# EAGLE design fish_tank (EAGLE 7.5.0)
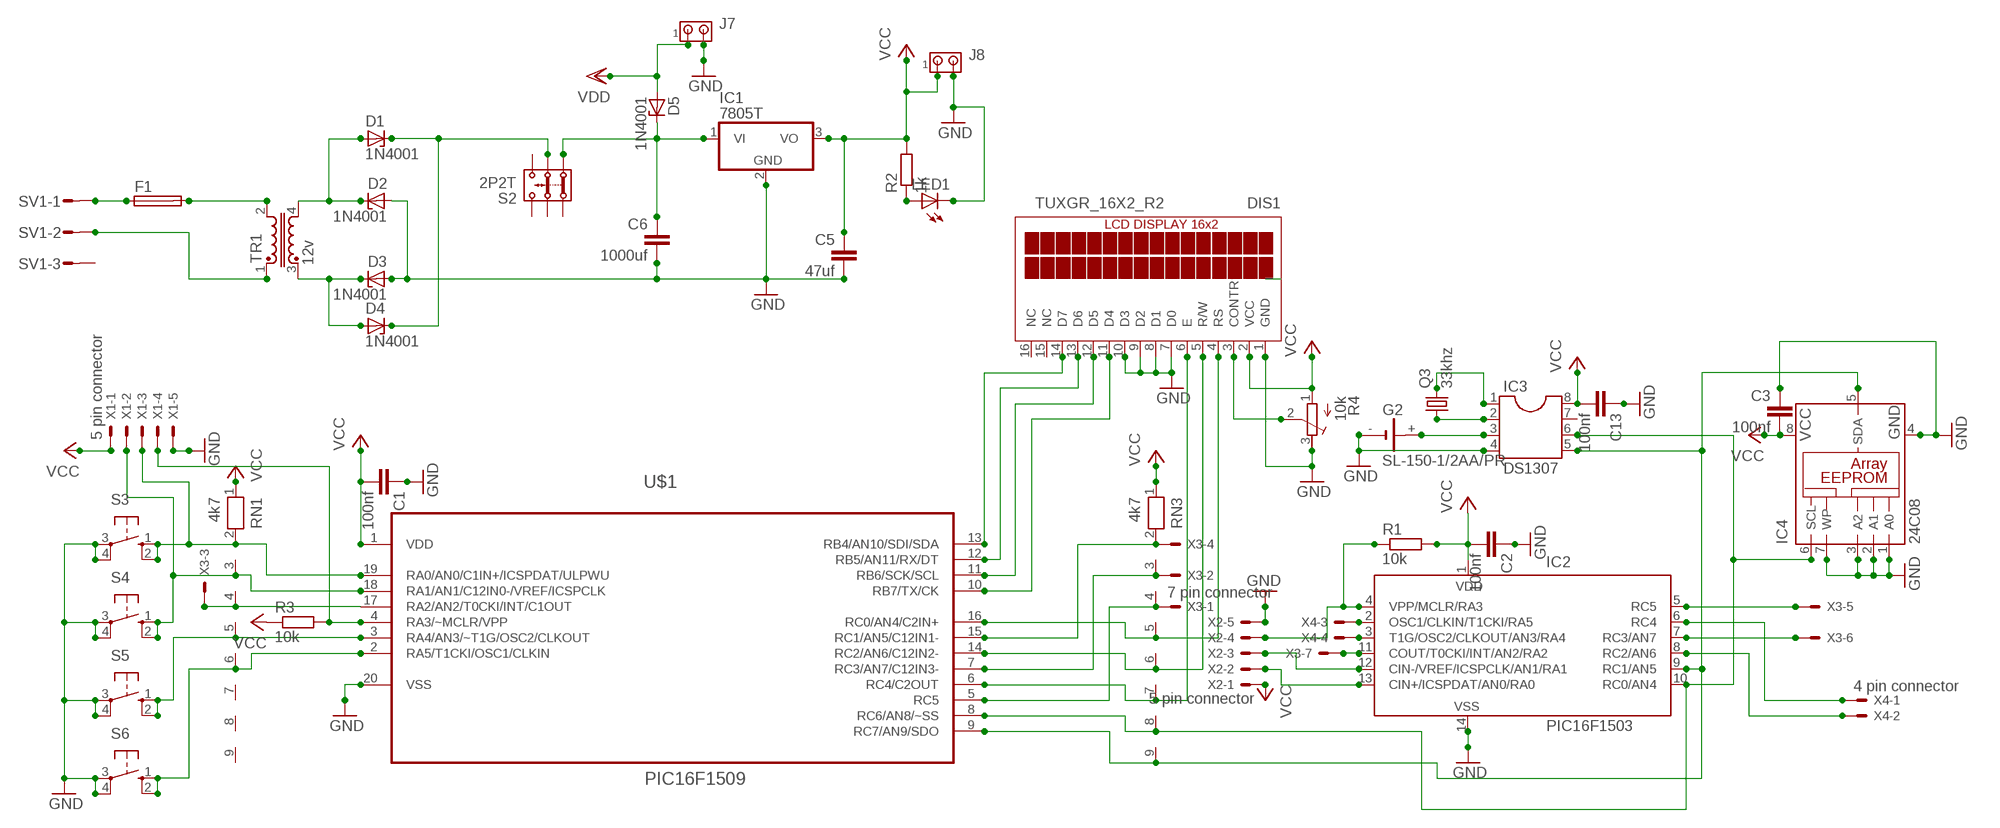
[diagram p0: schematic, sheet 1]

## Parts
C1  100nf  C2.5/4  [C2.5-4]
C2  100nf  C2.5/4  [C2.5-4]
C3  100nf  C5/2.5  [C5B2.5]
C5  47uf  C5/2.5  [C5B2.5]
C6  1000uf  C5/2.5  [C5B2.5]
C13  100nf  C5/2.5  [C5B2.5]
D1  1N4001  1N821  [DO35Z10]
D2  1N4001  1N821  [DO35Z10]
D3  1N4001  1N821  [DO35Z10]
D4  1N4001  1N821  [DO35Z10]
D5  1N4001  1N821  [DO35Z10]
DIS1  TUXGR_16X2_R2  [TUXGR_16X2_R2]
F1  SH25  [SH25]
G2  SL-150-1/2AA/PR  [SL-150-1/2AA/PR]
IC1  7805T  [TO220H]
IC2  PIC16F1503  PIC16F676P  [DIL14]
IC3  DS1307  DIL8  [DIL08]
IC4  24C08  24C04CP  [DIL8]
J7  MTA02-100  [10X02MTA]
J8  MTA02-100  [10X02MTA]
LED1  LED3MM  [LED3MM]
Q3  33khz  CRYSTALTC26H  [TC26H]
R1  10k  R-EU_0207/7  [0207/7]
R2  1k  R-EU_0204/5  [0204/5]
R3  10k  R-EU_0207/7  [0207/7]
R4  10k  R-TRIMM64W  [RTRIM64W]
RN1  4k7  RN08  [RN-9]
RN3  4k7  RN08  [RN-9]
S2  2P2T  [2P2T]
S3  10-XX  [B3F-10XX]
S4  10-XX  [B3F-10XX]
S5  10-XX  [B3F-10XX]
S6  10-XX  [B3F-10XX]
SV1  MT6-3Y  [MT6-3Y]
TR1  12v  U15-TRANSFORMER  [U15]
U$1  PIC16F1509  PIC16F689-I/P  [DIP254P762X533-20]
X1  5 pin connector  22-23-2051  [22-23-2051]
X2  5 pin connector  22-23-2051  [22-23-2051]
X3  7 pin connector  22-23-2071  [22-23-2071]
X4  4 pin connector  22-23-2041  [22-23-2041]

## Nets
GND: C1.1 C2.1 C3.1 C5.2 C6.2 C13.1 D2.A D3.A DIS1.1(GND) DIS1.7(D0) DIS1.8(D1) DIS1.9(D2) DIS1.10(D3) G2.- IC1.2(GND) IC2.14(VSS) IC3.4 IC4.1(A0) IC4.2(A1) IC4.3(A2) IC4.4(GND) IC4.7(WP) J7.2 J8.2 LED1.K(C) R4.3(E) S3.3(P) S3.4(P1) S4.3(P) S4.4(P1) S5.3(P) S5.4(P1) S6.3(P) S6.4(P1) U$1.20(VSS) X1.5 X2.5
N$1: D3.C D4.A TR1.3
N$2: D1.A D2.C TR1.4
N$3: RN1.5 S5.1(S) S5.2(S1) U$1.3(RA4/AN3/~T1G/OSC2/CLKOUT)
N$4: DIS1.3(CONTR) R4.2(S)
N$5: RN1.6 S6.1(S) S6.2(S1) U$1.2(RA5/T1CKI/OSC1/CLKIN)
N$6: C6.1 D5.C IC1.1(VI) S2.1.2
N$7: RN1.2 S3.1(S) S3.2(S1) U$1.19(RA0/AN0/C1IN+/ICSPDAT/ULPWU) X1.3
N$8: RN1.3 S4.1(S) S4.2(S1) U$1.18(RA1/AN1/C12IN0-/VREF/ICSPCLK) X1.2
N$9: IC2.13(CIN+/ICSPDAT/AN0/RA0) X2.2
N$10: IC2.6(RC4) X4.1
N$12: IC2.4(VPP/MCLR/RA3) R1.1 X2.4
N$13: DIS1.6(E) RN3.7 U$1.6(RC4/C2OUT)
N$14: IC2.5(RC5) X3.5
N$15: IC2.7(RC3/AN7) X3.6
N$16: DIS1.4(RS) RN3.5 U$1.16(RC0/AN4/C2IN+)
N$17: DIS1.5(R/W) RN3.6 U$1.14(RC2/AN6/C12IN2-)
N$18: IC2.10(RC0/AN4) IC3.6 IC4.6(SCL) RN3.8 U$1.8(RC6/AN8/~SS)
N$19: IC2.11(COUT/T0CKI/INT/AN2/RA2) X3.7
N$20: IC2.12(CIN-/VREF/ICSPCLK/AN1/RA1) X2.3
N$21: IC2.9(RC1/AN5) IC3.5 IC4.5(SDA) RN3.9 U$1.9(RC7/AN9/SDO)
N$22: RN1.4 U$1.17(RA2/AN2/T0CKI/INT/C1OUT) X3.3
N$23: RN3.2 U$1.15(RC1/AN5/C12IN1-) X3.4
N$24: RN3.3 U$1.7(RC3/AN7/C12IN3-) X3.2
N$25: RN3.4 U$1.5(RC5) X3.1
N$26: DIS1.14(D7) U$1.13(RB4/AN10/SDI/SDA)
N$27: DIS1.13(D6) U$1.12(RB5/AN11/RX/DT)
N$28: DIS1.12(D5) U$1.11(RB6/SCK/SCL)
N$29: DIS1.11(D4) U$1.10(RB7/TX/CK)
N$30: R3.2 U$1.4(RA3/~MCLR/VPP) X1.4
N$31: IC2.8(RC2/AN6) X4.2
N$32: IC2.2(OSC1/CLKIN/T1CKI/RA5) X4.3
N$33: IC2.3(T1G/OSC2/CLKOUT/AN3/RA4) X4.4
N$38: SV1.2 TR1.1
N$57: F1.1 SV1.1
N$61: F1.2 TR1.2
N$63: G2.+ IC3.3
N$64: IC3.2 Q3.1
N$65: D1.C D4.C S2.2.2
N$66: LED1.A R2.1
N$70: IC3.1 Q3.2
VCC: C1.2 C2.2 C3.2 C5.1 C13.2 DIS1.2(VCC) IC1.3(VO) IC2.1(VDD) IC3.8 IC4.8(VCC) J8.1 R1.2 R2.2 R3.1 R4.1(A) RN1.1 RN3.1 U$1.1(VDD) X1.1 X2.1
VDD: D5.A J7.1
Unconnected: DIS1.15(NC) DIS1.16(NC) IC3.7 RN1.7 RN1.8 RN1.9 S2.1.1 S2.2.1 S2.3.1 S2.3.2 SV1.3

## Library data of the parts
C1-C3 C5 C6 C13 = capacitor-wima:C: CAPACITOR naming: grid - package width
D1-D5 = diode:1N821: Reference DIODE temperature compensated, 6,2 V
DIS1 = display-lcd:TUXGR_16X2_R2: Tuxgraphics LCD display 16x2 characters reflective, without background light Source: tuxgr_12x2_r2.pdf; OC_FARNELL: unknown; OC_NEWARK: unknown
F1 = fuse:SH25: FUSE HOLDER grid 25 mm, OGN0031 8211, Schurter (Buerklin); MF: SCHURTER; MPN: 0031.8211; OC_FARNELL: 1162741; OC_NEWARK: 96B9380
G2 = battery:SL-150-1/2AA/PR: LI BATTERY Sonnenschein
IC1 = linear:78*: Positive VOLTAGE REGULATOR Source: http://cache.national.com/ds/LM/LM78L05.pdf http://www.fairchildsemi.com/ds/LM/LM7805.pdf
IC2 = microchip:PIC16F676: 14-Pin, Flash-Based 8-Bit CMOS Microcontroller High Performance RISC CPU: * Only 35 instructions to learn - All single-cycle instructions except branches * Operating speed: - DC - 20 MHz oscillator/clock input - DC - 200 ns instruction cycle * Internal and external oscillator options - Precision Internal 4 MHz oscillator factory calibrated to ±1% - External Oscillator support for crystals and resonators - 5?s wake-up from SLEEP, 3.0V, typical * Power saving SLEEP mode * Wide operating voltage range - 2.0V to 5.5V * Industrial and Extended temperature range * Low power Power-on Reset (POR) * Power-up Timer (PWRT) and Oscillator Start-up Timer (OST) * Brown-out Detect (BOD) * Watchdog Timer (WDT) with independent oscillator for reliable operation * Multiplexed MCLR/Input-pin * Interrupt-on-pin change * Individual programmable weak pull-ups * Programmable code protection * High Endurance FLASH/EEPROM Cell - 100,000 write FLASH endurance - 1,000,000 write EEPROM endurance - FLASH/Data EEPROM Retention: > 40 years * Standby Current: - 1 nA @ 2.0V, typical * Operating Current: - 8.5?A @ 32 kHz, 2.0V, typical - 100?A @ 1 MHz, 2.0V, typical * Watchdog Timer Current - 300 nA @ 2.0V, typical * Timer1 oscillator current: - 4?A @ 32 kHz, 2.0V, typical * 12 I/O pins with individual direction control * High current sink/source for direct LED drive * Analog-to-Digital Converter module (PIC16F676): - 10-bit resolution - Programmable 8-channel input - Voltage reference input * In-Circuit Serial ProgrammingTM (ICSPTM) via two pins Source: http://ww1.microchip.com/downloads/en/DeviceDoc/40039E.pdf; MF: MICROCHIP; MPN: PIC16F676-I/P; OC_FARNELL: 9760512; OC_NEWARK: 54K2829
IC3 = ic-package:DIL8: Dual In Line / Socket
IC4 = microchip:24C*: Serial EEPROM 1 K/2 K/4 K; MPN: CAT24C04LI-G; OC_FARNELL: 1718374; OC_NEWARK: 73P4460
J7 J8 = con-amp:MTA02-100: AMP connector
LED1 = led:LED: LED OSRAM: - CHIPLED LG R971, LG N971, LY N971, LG Q971, LY Q971, LO R971, LY R971 LH N974, LH R974 LS Q976, LO Q976, LY Q976 LO Q996 - Hyper CHIPLED LW Q18S LB Q993, LB Q99A, LB R99A - SideLED LS A670, LO A670, LY A670, LG A670, LP A670 LB A673, LV A673, LT A673, LW A673 LH A674 LY A675 LS A676, LA A676, LO A676, LY A676, LW A676 LS A679, LY A679, LG A679 - Hyper Micro SIDELED® LS Y876, LA Y876, LO Y876, LY Y876 LT Y87S - SmartLED LW L88C, LW L88S LB L89C, LB L89S, LG L890 LS L89K, LO L89K, LY L89K LS L896, LA L896, LO L896, LY L896 - TOPLED LS T670, LO T670, LY T670, LG T670, LP T670 LSG T670, LSP T670, LSY T670, LOP T670, LYG T670 LG T671, LOG T671, LSG T671 LB T673, LV T673, LT T673, LW T673 LH T674 LS T676, LA T676, LO T676, LY T676, LB T676, LH T676, LSB T676, LW T676 LB T67C, LV T67C, LT T67C, LS T67K, LO T67K, LY T67K, LW E67C LS E67B, LA E67B, LO E67B, LY E67B, LB E67C, LV E67C, LT E67C LW T67C LS T679, LY T679, LG T679 LS T770, LO T770, LY T770, LG T770, LP T770 LB T773, LV T773, LT T773, LW T773 LH T774 LS E675, LA E675, LY E675, LS T675 LS T776, LA T776, LO T776, LY T776, LB T776 LHGB T686 LT T68C, LB T68C - Hyper Mini TOPLED® LB M676 - Mini TOPLED Santana® LG M470 LS M47K, LO M47K, LY M47K Source: http://www.osram.convergy.de LUXEON: - LUMILED® LXK2-PW12-R00, LXK2-PW12-S00, LXK2-PW14-U00, LXK2-PW14-V00 LXK2-PM12-R00, LXK2-PM12-S00, LXK2-PM14-U00 LXK2-PE12-Q00, LXK2-PE12-R00, LXK2-PE12-S00, LXK2-PE14-T00, LXK2-PE14-U00 LXK2-PB12-K00, LXK2-PB12-L00, LXK2-PB12-M00, LXK2-PB14-N00, LXK2-PB14-P00, LXK2-PB14-Q00 LXK2-PR12-L00, LXK2-PR12-M00, LXK2-PR14-Q00, LXK2-PR14-R00 LXK2-PD12-Q00, LXK2-PD12-R00, LXK2-PD12-S00 LXK2-PH12-R00, LXK2-PH12-S00 LXK2-PL12-P00, LXK2-PL12-Q00, LXK2-PL12-R00 Source: www.luxeon.com KINGBRIGHT: KA-3528ASYC Source: www.kingbright.com
Q3 = crystal:CRYSTAL: CRYSTAL; OC_FARNELL: unknown; OC_NEWARK: unknown
R1 R3 = rcl:R-EU_: RESISTOR, European symbol
R2 = resistor:R-EU_: RESISTOR, European symbol
R4 = rcl:R-TRIMM: Trimm resistor
RN1 RN3 = resistor-net:RN08: RESISTOR NETWORK; OC_FARNELL: unknown; OC_NEWARK: unknown
S2 = switch:2P2T: SLIDE SWITCH 2P2T Part No. SS-22F05-G(A)4 Source: CANAL ELECTRONIC CO., LTD .. switsch.pdf
S3-S6 = switch-omron:10-XX: OMRON SWITCH; MPN: B3F-1000; OC_FARNELL: 176432; OC_NEWARK: 36M3542
SV1 = con-amp-mt:MT6-3Y: AMP MT6 CONNECTOR; OC_FARNELL: unknown; OC_NEWARK: unknown
TR1 = inductor-neosid:U15: TRANSFORMER U15; OC_FARNELL: unknown; OC_NEWARK: unknown
U$1 = Microchip_By_element14_Batch_1:PIC16F689-I/P: CMOS Microcontrollers; MPN: PIC16F689-I/P; OC_FARNELL: 1103403; OC_NEWARK: 56J7539; PACKAGE: DIP-20; SUPPLIER: Microchip
X1 X2 = con-molex:22-23-2051: .100" (2.54mm) Center Header - 5 Pin; MF: MOLEX; MPN: 22-23-2051; OC_FARNELL: 1462952; OC_NEWARK: 38C9178
X3 = con-molex:22-23-2071: .100" (2.54mm) Center Header - 7 Pin; MF: MOLEX; MPN: 22-23-2071; OC_FARNELL: 1654534; OC_NEWARK: 56H0445
X4 = con-molex:22-23-2041: .100" (2.54mm) Center Header - 4 Pin; MF: MOLEX; MPN: 22-23-2041; OC_FARNELL: 1462920; OC_NEWARK: 38C0355

## Board
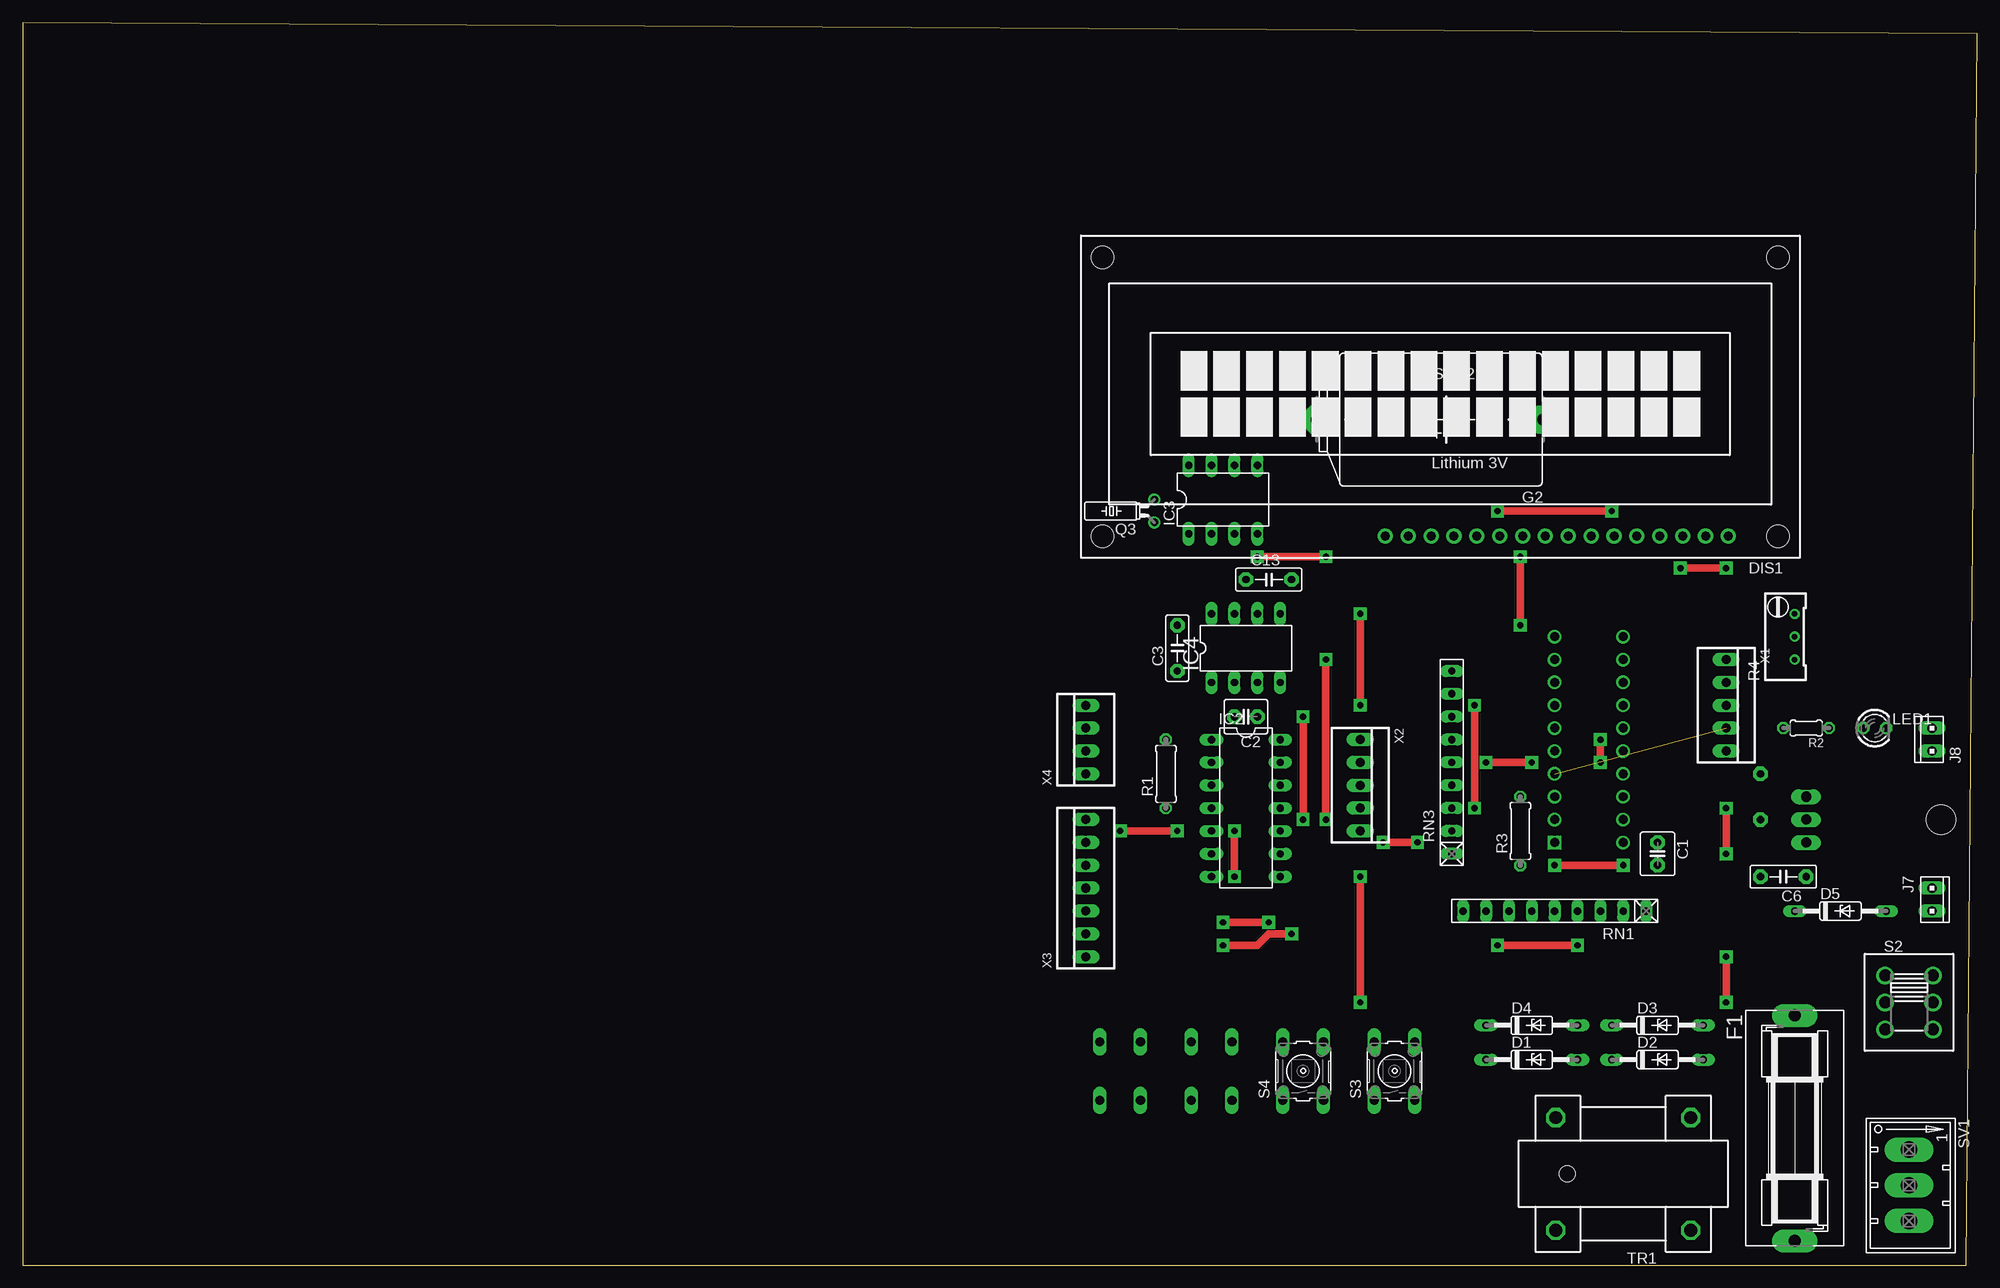
[diagram p1: board, top side]
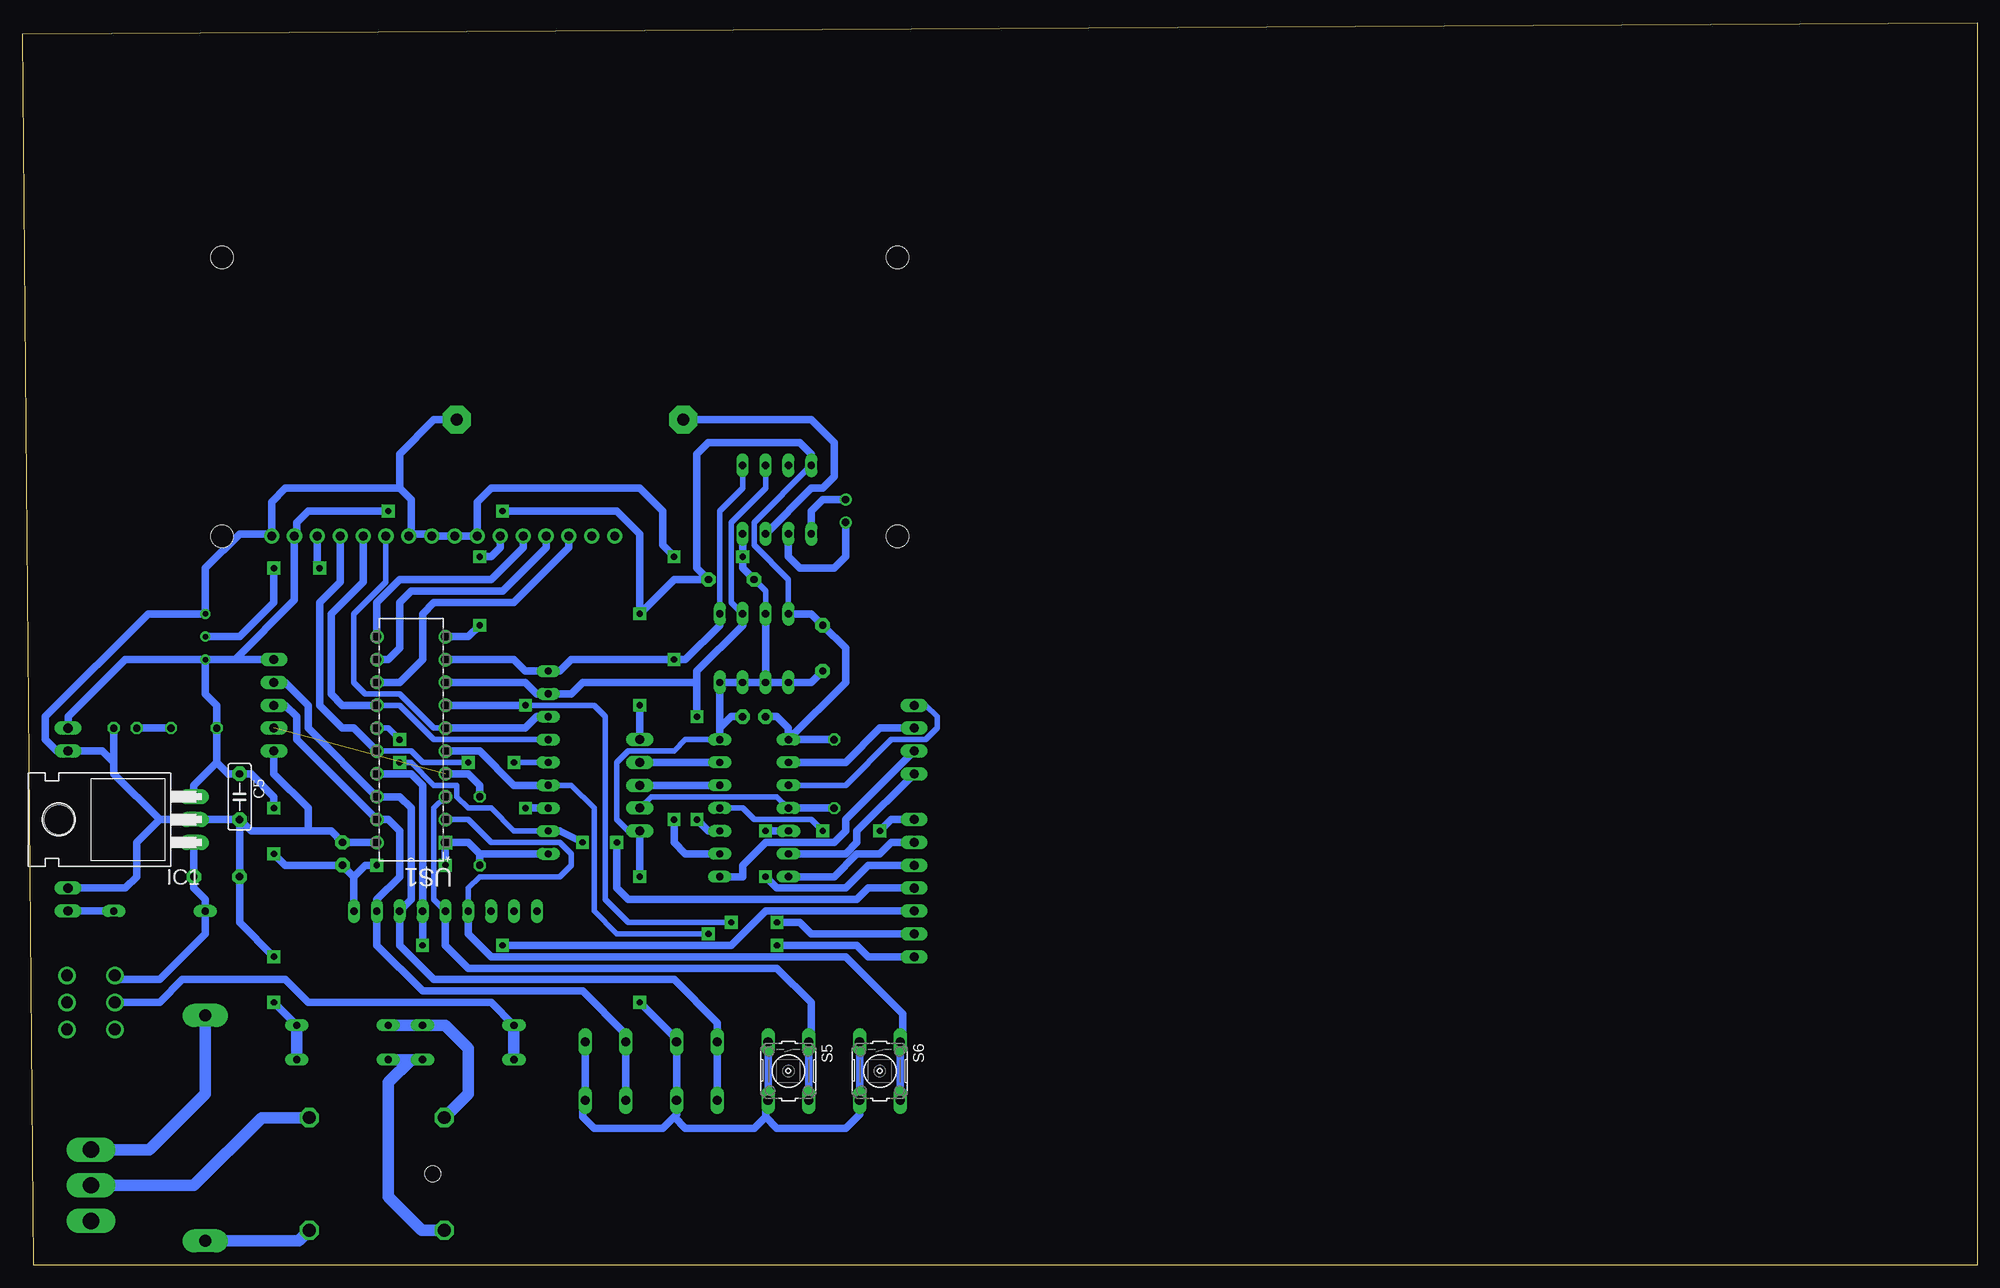
[diagram p2: board, bottom side, seen from below]

Size 217.15 x 138.1 mm. Coordinates in mm from the lower left corner, seen from the top.
Outline: 0,0 215.88,0 217.15,136.83 0,138.1 0,0
Copper layers (1*16): Top 0.035mm / dielectric 1.5mm / Bottom 0.035mm
Design rules "default": minimum track width 10mil, minimum drill 24mil, track to track 8mil, track to pad 8mil, pad to pad 8mil, via to via 8mil, smd to smd 8mil, copper to edge 40mil, drill to drill 8mil, minimum pad ring 10mil, minimum via ring 8mil, stop-mask expansion 4mil, vias tented up to drill 0mil, thermal gap 10mil

### Footprints (pad centres in the part's own frame; a part is rotated, then mirrored left to right if it is on the bottom)
C2.5-4 = drill 0.813 pad 1.6 octagon: 1 -1.27,0; 2 1.27,0
C5B2.5 = drill 0.813 pad 1.6 octagon: 1 -2.54,0; 2 2.54,0
DO35Z10 = drill 0.813 long: A 5.08,0; C -5.08,0
TUXGR_16X2_R2 = drill 1 pad 1.676: 1 -32,15.5; 2 -29.46,15.5; 3 -26.92,15.5; 4 -24.38,15.5; 5 -21.84,15.5; 6 -19.3,15.5; 7 -16.76,15.5; 8 -14.22,15.5; 9 -11.68,15.5; 10 -9.14,15.5; 11 -6.6,15.5; 12 -4.06,15.5; 13 -1.52,15.5; 14 1.02,15.5; 15 3.56,15.5; 16 6.1,15.5 | hole 2.5: -37.5,-15.5; 37.5,-15.5; -37.5,15.5; 37.5,15.5
SH25 = drill 1.321 pad 2.54 long: 1 -12.522,0; 2 12.522,0
SL-150-1/2AA/PR = drill 1.321 pad 3.15 octagon: + 12.446,0; - -12.7,0
TO220H = drill 1.118 long: 1 -2.54,-10.16; 2 0,-10.16; 3 2.54,-10.16 | hole 3.302: 0,4.826
DIL14 = drill 0.813 long: 1 -7.62,-3.81; 2 -5.08,-3.81; 3 -2.54,-3.81; 4 0,-3.81; 5 2.54,-3.81; 6 5.08,-3.81; 7 7.62,-3.81; 8 7.62,3.81; 9 5.08,3.81; 10 2.54,3.81; 11 0,3.81; 12 -2.54,3.81; 13 -5.08,3.81; 14 -7.62,3.81
DIL08 = drill 0.813 long: 1 -3.81,-3.81; 2 -1.27,-3.81; 3 1.27,-3.81; 4 3.81,-3.81; 5 3.81,3.81; 6 1.27,3.81; 7 -1.27,3.81; 8 -3.81,3.81
DIL8 = drill 0.813 long: 1 -3.81,-3.81; 2 -1.27,-3.81; 3 1.27,-3.81; 4 3.81,-3.81; 5 3.81,3.81; 6 1.27,3.81; 7 -1.27,3.81; 8 -3.81,3.81
10X02MTA = drill 1.016 long: 1 1.27,0; 2 -1.27,0
LED3MM = drill 0.813 octagon: A -1.27,0; K 1.27,0
TC26H = drill 0.813: 1 -1.27,0; 2 1.27,0
0207/7 = drill 0.813 octagon: 1 -3.81,0; 2 3.81,0
0204/5 = drill 0.813 octagon: 1 -2.54,0; 2 2.54,0
RTRIM64W = drill 0.61: 1 1.27,-2.54; 2 1.27,0; 3 1.27,2.54
RN-9 = drill 0.813 long: 1 -10.16,0; 2 -7.62,0; 3 -5.08,0; 4 -2.54,0; 5 0,0; 6 2.54,0; 7 5.08,0; 8 7.62,0; 9 10.16,0
2P2T = drill 1.3 pad 1.93: 1.1 -3,2.65; 1.2 -3,-2.65; 2.1 0,2.65; 2.2 0,-2.65; 3.1 3,2.65; 3.2 3,-2.65
B3F-10XX = drill 1.016 long: 1 -3.251,2.261; 2 3.251,2.261; 3 -3.251,-2.261; 4 3.251,-2.261
MT6-3Y = drill 1.803 long: 1 -3.962,0; 2 0,0; 3 3.962,0
U15 = drill 1.422 octagon: 1 -7.5,-6.25; 2 -7.5,6.25; 3 7.5,-6.25; 4 7.5,6.25 | hole 1.8: 6.2,0
DIP254P762X533-20 = drill 0.991 square: 1 -7.62,22.86 | drill 0.991: 2 -7.62,20.32; 3 -7.62,17.78; 4 -7.62,15.24; 5 -7.62,12.7; 6 -7.62,10.16; 7 -7.62,7.62; 8 -7.62,5.08; 9 -7.62,2.54; 10 -7.62,0; 11 0,0; 12 0,2.54; 13 0,5.08; 14 0,7.62; 15 0,10.16; 16 0,12.7; 17 0,15.24; 18 0,17.78; 19 0,20.32; 20 0,22.86
22-23-2051 = drill 1 long: 1 -5.08,0; 2 -2.54,0; 3 0,0; 4 2.54,0; 5 5.08,0
22-23-2071 = drill 1 long: 1 -7.62,0; 2 -5.08,0; 3 -2.54,0; 4 0,0; 5 2.54,0; 6 5.08,0; 7 7.62,0
22-23-2041 = drill 1 long: 1 -3.81,0; 2 -1.27,0; 3 1.27,0; 4 3.81,0

### Placement (x,y rotation side)
C1  181.61,45.72 270 top
C2  135.89,60.96 180 top
C3  128.27,68.58 90 top
C5  193.04,52.07 270 bottom
C6  195.58,43.18 180 top
C13  138.43,76.2 0 top
D1  167.64,22.86 0 top
D2  181.61,22.86 0 top
D3  181.61,26.67 0 top
D4  167.64,26.67 0 top
D5  201.93,39.37 0 top
DIS1  157.48,96.52 180 top
F1  196.85,15.24 270 top
G2  156.21,93.98 180 top
IC1  208.28,49.53 90 bottom
IC2  135.89,50.8 270 top
IC3  133.35,85.09 0 top
IC4  135.89,68.58 0 top
J7  212.09,40.64 270 top
J8  212.09,58.42 90 top
LED1  205.74,59.69 0 top
Q3  125.73,83.82 90 top
R1  127,54.61 90 top
R2  198.12,59.69 180 top
R3  166.37,48.26 90 top
R4  195.58,69.85 0 top
RN1  170.18,39.37 180 top
RN3  158.75,55.88 90 top
S2  209.55,29.21 270 top
S3  152.4,21.59 90 top
S4  142.24,21.59 90 top
S5  132.08,21.59 270 bottom
S6  121.92,21.59 270 bottom
SV1  209.55,8.89 270 top
TR1  177.8,10.16 180 top
U$1  177.8,69.85 180 bottom
X1  189.23,62.23 270 top
X2  148.59,53.34 270 top
X3  118.11,41.91 90 top
X4  118.11,58.42 90 top

### Tracks (layer width: path | path; a pad name or v marks a point on that pad's centre or on a via)
GND  (via drill 0.7 pad 1.42)
  Top 0.813: v144.78,78.74 v137.16,78.74 | v148.59,43.18 v148.59,29.21 | v189.23,34.29 v189.23,29.21
  Bottom 0.61: C13.1 134.62,74.93 IC4.7 | IC2.14 143.51,58.42 144.78,57.15 149.86,57.15 151.13,55.88 151.13,49.53 149.86,48.26 X2.5
  Bottom 0.813: 201.93,49.53 IC1.2 C5.2 | 201.93,49.53 204.47,46.99 204.47,43.18 205.74,41.91 J7.2 | C5.2 C6.2 193.04,38.1 v189.23,34.29 | 201.93,49.53 207.01,54.61 207.01,55.88 | 207.01,55.88 LED1.K | 207.01,55.88 208.28,57.15 J8.2 213.36,57.15 214.63,58.42 214.63,60.96 203.2,72.39 R4.3 196.85,77.47 193.04,81.28 189.74,81.28 DIS1.1 189.48,84.84 187.96,86.36 175.26,86.36 | 175.26,86.36 173.99,85.09 173.99,81.27 | 173.99,81.27 DIS1.7 | 173.99,81.27 171.95,81.27 DIS1.8 DIS1.9 DIS1.10 166.62,84.84 165.1,86.36 148.59,86.36 146.05,83.82 146.05,80.01 v144.78,78.74 | D3.A v189.23,29.21 | U$1.20 C1.1 182.88,48.26 185.42,48.26 | 185.42,48.26 191.77,48.26 C5.2 | S3.4 S3.3 | S3.3 154.66,18.06 154.94,17.78 | 154.94,17.78 154.94,18.06 S3.3 | 144.78,16.51 144.5,16.79 S4.3 S4.4 144.5,25.12 v148.59,29.21 | 144.78,16.51 146.05,15.24 153.67,15.24 154.94,16.51 154.94,17.78 | 134.62,16.51 133.35,15.24 125.73,15.24 124.18,16.79 S6.4 S6.3 | 134.62,16.51 134.62,18.06 S5.4 S5.3 | 134.62,16.51 135.89,15.24 143.51,15.24 144.78,16.51 | X1.5 189.23,54.61 185.42,50.8 185.42,48.26 | IC4.2 IC4.7 | IC4.2 IC4.3 IC4.4 139.7,59.69 | IC4.2 IC4.1 129.54,64.77 C3.1 | X2.5 v148.59,43.18 | 139.7,59.69 IC2.14 | C2.1 138.43,60.96 139.7,59.69 | G2.- 171.45,93.98 175.26,90.17 175.26,86.36 | IC3.4 v137.16,78.74 137.16,77.47 C13.1
  Bottom 1.27: D3.A D2.A
N$1
  Bottom 1.27: D3.C D4.A 170.18,26.67 167.64,24.13 167.64,19.05 170.28,16.41 TR1.3
N$2
  Bottom 1.27: D2.C 173.99,22.86 | 173.99,22.86 D1.A | TR1.4 172.82,3.91 176.53,7.62 176.53,20.32 173.99,22.86
N$3
  Bottom 0.61: U$1.3 171.45,50.8 171.45,40.64 RN1.5
  Bottom 0.813: RN1.5 170.18,35.56 167.64,33.02 133.35,33.02 129.54,29.21 129.54,25.12 S5.1 S5.2
N$4  (via drill 0.7 pad 1.42)
  Top 0.813: v189.23,77.47 v184.15,77.47
  Bottom 0.813: DIS1.3 184.4,77.72 v184.15,77.47 | v189.23,77.47 189.23,73.66 193.04,69.85 R4.2
N$5
  Bottom 0.61: U$1.2 167.64,49.53 165.1,46.99 157.48,46.99 156.21,45.72 156.21,44.45 157.48,43.18 166.37,43.18 167.64,41.91 RN1.6
  Bottom 0.813: RN1.6 167.64,36.83 165.1,34.29 125.73,34.29 119.38,27.94 119.38,25.12 S6.1 S6.2
N$6
  Bottom 0.813: IC1.1 C6.1 198.12,41.91 196.85,40.64 D5.C 196.85,36.83 201.93,31.75 206.44,31.75 S2.1.2
N$7
  Bottom 0.813: S3.1 S3.2 150.14,25.68 154.94,30.48 172.72,30.48 177.8,35.56 RN1.2 177.8,40.64 175.26,43.18 175.26,48.26 176.53,49.53 U$1.19 186.69,58.42 186.69,60.96 187.96,62.23 X1.3
N$8
  Bottom 0.813: S4.2 139.98,26.95 144.78,31.75 171.45,31.75 175.26,35.56 RN1.3 173.99,40.64 173.99,50.8 175.26,52.07 U$1.18 185.42,59.69 185.42,62.23 187.96,64.77 X1.2 | S4.1 S4.2 | S4.2 139.98,25.12 139.7,25.4 139.7,25.12 S4.2
N$9
  Bottom 0.813: X2.2 IC2.13
N$10
  Bottom 0.813: X4.1 124.46,48.26 124.46,46.99 125.73,45.72 IC2.6
N$12
  Bottom 0.61: X2.4 147.32,52.07 133.35,52.07 IC2.4
  Bottom 0.813: R1.1 IC2.4
N$13
  Bottom 0.61: DIS1.6 176.78,75.95 180.34,72.39 180.34,64.77 179.07,63.5 175.26,63.5 171.45,59.69 U$1.6
  Bottom 0.813: RN3.7 160.02,60.96 161.29,59.69 U$1.6
N$14  (via drill 0.7 pad 1.42)
  Top 0.813: v134.62,43.18 v134.62,48.26
  Bottom 0.813: X3.5 123.19,44.45 125.73,41.91 133.35,41.91 v134.62,43.18 | IC2.5 v134.62,48.26
N$15
  Bottom 0.813: IC2.7 127,43.18 124.46,45.72 121.92,45.72 120.65,46.99 X3.6
N$16  (via drill 0.7 pad 1.42)
  Top 0.813: v162.56,55.88 v167.64,55.88
  Bottom 0.61: U$1.16 173.99,57.15 172.72,55.88 v167.64,55.88 | RN3.5 v162.56,55.88
  Bottom 0.813: DIS1.4 181.86,75.95 184.15,73.66 184.15,62.23 181.61,59.69 180.34,59.69 U$1.16
N$17
  Bottom 0.61: U$1.14 175.26,62.23 171.45,58.42 RN3.6
  Bottom 0.813: DIS1.5 179.32,75.95 182.88,72.39 182.88,63.5 181.61,62.23 U$1.14
N$18  (via drill 0.7 pad 1.42)
  Top 0.813: v142.24,60.96 v142.24,49.53
  Bottom 0.61: IC4.6 138.43,73.66 138.43,82.55 134.62,86.36 IC3.6
  Bottom 0.813: U$1.8 161.29,64.77 160.02,63.5 RN3.8 156.21,63.5 154.94,64.77 142.24,64.77 | IC4.6 137.16,71.12 142.24,66.04 142.24,64.77 | IC2.10 140.97,48.26 v142.24,49.53 | 142.24,64.77 v142.24,60.96
N$19  (via drill 0.7 pad 1.42)
  Top 0.813: v121.92,48.26 v128.27,48.26
  Bottom 0.61: IC2.11 137.16,50.8 135.89,49.53 129.54,49.53 v128.27,48.26
  Bottom 0.813: X3.7 120.65,49.53 v121.92,48.26
N$20
  Bottom 0.813: X2.3 IC2.12
N$21  (via drill 0.7 pad 1.42)
  Top 0.813: v144.78,67.31 v144.78,49.53
  Bottom 0.61: IC3.5 137.16,86.36 139.7,83.82 IC4.5
  Bottom 0.813: U$1.9 162.56,67.31 161.29,66.04 RN3.9 157.48,66.04 156.21,67.31 v144.78,67.31 143.51,67.31 139.7,71.12 IC4.5 | IC2.9 143.51,45.72 144.78,46.99 v144.78,49.53
N$22  (via drill 0.7 pad 1.42)
  Top 0.813: v163.83,35.56 v172.72,35.56
  Bottom 0.813: U$1.17 173.99,54.61 172.72,53.34 RN1.4 v172.72,35.56 | X3.3 134.62,39.37 138.43,35.56 v163.83,35.56
N$23  (via drill 0.7 pad 1.42)
  Top 0.813: v175.26,58.42 v175.26,55.88 | v154.94,46.99 v151.13,46.99
  Bottom 0.61: U$1.15 176.53,59.69 v175.26,58.42 | RN3.2 162.56,48.26 165.1,50.8 167.64,50.8 168.91,52.07 168.91,53.34 171.45,53.34 173.99,55.88 v175.26,55.88
  Bottom 0.813: X3.4 123.19,41.91 124.46,40.64 149.86,40.64 151.13,41.91 v151.13,46.99 | RN3.2 157.48,48.26 v154.94,46.99
N$24  (via drill 0.7 pad 1.42)
  Top 0.813: v161.29,50.8 v161.29,62.23 | v138.43,38.1 v133.35,38.1
  Bottom 0.61: v161.29,62.23 153.67,62.23 152.4,60.96 152.4,40.64 149.86,38.1 v138.43,38.1
  Bottom 0.813: X3.2 129.54,36.83 130.81,38.1 v133.35,38.1 | U$1.7 v161.29,62.23 | RN3.3 v161.29,50.8
N$25  (via drill 0.7 pad 1.42)
  Top 0.813: v133.35,35.56 137.16,35.56 138.43,36.83 v140.97,36.83
  Bottom 0.61: RN3.4 156.21,53.34 153.67,50.8 153.67,39.37 151.13,36.83 v140.97,36.83
  Bottom 0.813: U$1.5 166.37,57.15 162.56,53.34 RN3.4 | X3.1 123.19,34.29 124.46,35.56 v133.35,35.56
N$26
  Bottom 0.813: DIS1.14 156.46,79.76 162.56,73.66 171.45,73.66 172.72,72.39 172.72,67.31 175.26,64.77 U$1.13
N$27
  Bottom 0.813: DIS1.13 159,79.76 163.83,74.93 173.99,74.93 175.26,73.66 175.26,68.58 176.53,67.31 U$1.12
N$28
  Bottom 0.813: DIS1.12 161.54,79.76 165.1,76.2 175.26,76.2 177.8,73.66 U$1.11
N$29  (via drill 0.7 pad 1.42)  (1 unrouted)
  Top 0.813: v166.37,78.74 v166.37,71.12
  Bottom 0.813: U$1.10 167.64,69.85 v166.37,71.12 | DIS1.11 164.08,79.76 165.1,78.74 v166.37,78.74
N$30  (1 unrouted)
  Bottom 0.813: R3.2 166.37,53.34 167.64,54.61 U$1.4
N$31
  Bottom 0.813: X4.2 125.73,49.53 125.73,48.26 127,46.99 134.62,46.99 137.16,44.45 137.16,43.18 IC2.8
N$32
  Bottom 0.813: X4.3 121.92,59.69 125.73,55.88 IC2.2
N$33
  Bottom 0.61: X4.4 116.84,62.23 115.57,60.96 115.57,59.69 116.84,58.42 120.65,58.42 125.73,53.34 IC2.3
N$38
  Bottom 1.27: TR1.1 190.6,16.41 198.12,8.89 SV1.2
N$57
  Bottom 1.27: SV1.1 203.05,12.85 196.85,19.05 F1.1
N$61
  Bottom 1.27: F1.2 186.49,2.72 TR1.2
N$63
  Bottom 0.813: G2.+ 129.54,93.98 127,91.44 127,87.63 128.27,86.36 129.54,86.36 IC3.3
N$64
  Bottom 0.813: Q3.1 125.73,78.74 127,77.47 130.81,77.47 132.08,78.74 IC3.2
N$65
  Bottom 0.813: D4.C 165.1,29.21 185.42,29.21 187.96,31.75 199.39,31.75 201.93,29.21 S2.2.2
  Bottom 1.27: D1.C D4.C
N$66
  Bottom 0.813: R2.1 LED1.A
N$70
  Bottom 0.813: Q3.2 128.27,85.09 129.54,83.82 IC3.1
VCC  (via drill 0.7 pad 1.42)
  Top 0.813: v163.83,83.82 v176.53,83.82 | v177.8,44.45 v170.18,44.45 | v148.59,72.39 v148.59,62.23 | v189.23,50.8 v189.23,45.72
  Bottom 0.61: IC4.8 132.08,76.2 135.89,80.01 135.89,82.55 IC3.8
  Bottom 0.813: J8.1 212.09,60.96 205.74,67.31 R4.1 | R4.1 196.85,63.5 195.58,62.23 R2.2 195.58,55.88 | R4.1 193.54,67.31 | 193.54,67.31 186.94,73.91 DIS1.2 186.69,81.27 186.69,82.55 185.42,83.82 v176.53,83.82 | 195.58,55.88 194.31,54.61 C5.1 191.77,54.61 189.23,52.07 v189.23,50.8 | IC1.3 198.12,53.34 195.58,55.88 | RN1.1 180.34,43.18 | 180.34,43.18 C1.2 187.96,44.45 v189.23,45.72 | 166.37,45.72 167.64,46.99 U$1.1 v170.18,44.45 | 166.37,45.72 R3.1 | 166.37,45.72 RN3.1 | 180.34,43.18 179.07,44.45 v177.8,44.45 | X1.1 193.54,67.31 | IC3.8 129.54,90.17 130.81,91.44 140.97,91.44 142.24,90.17 142.24,77.47 C13.2 144.78,76.2 v148.59,72.39 148.59,81.28 151.13,83.82 v163.83,83.82 | IC4.8 129.54,72.39 C3.2 125.73,68.58 125.73,64.77 IC2.1 | C2.2 133.35,60.96 132.08,59.69 IC2.1 | X2.1 v148.59,62.23 | IC2.1 R1.2
VDD
  Bottom 0.813: J7.1 D5.A